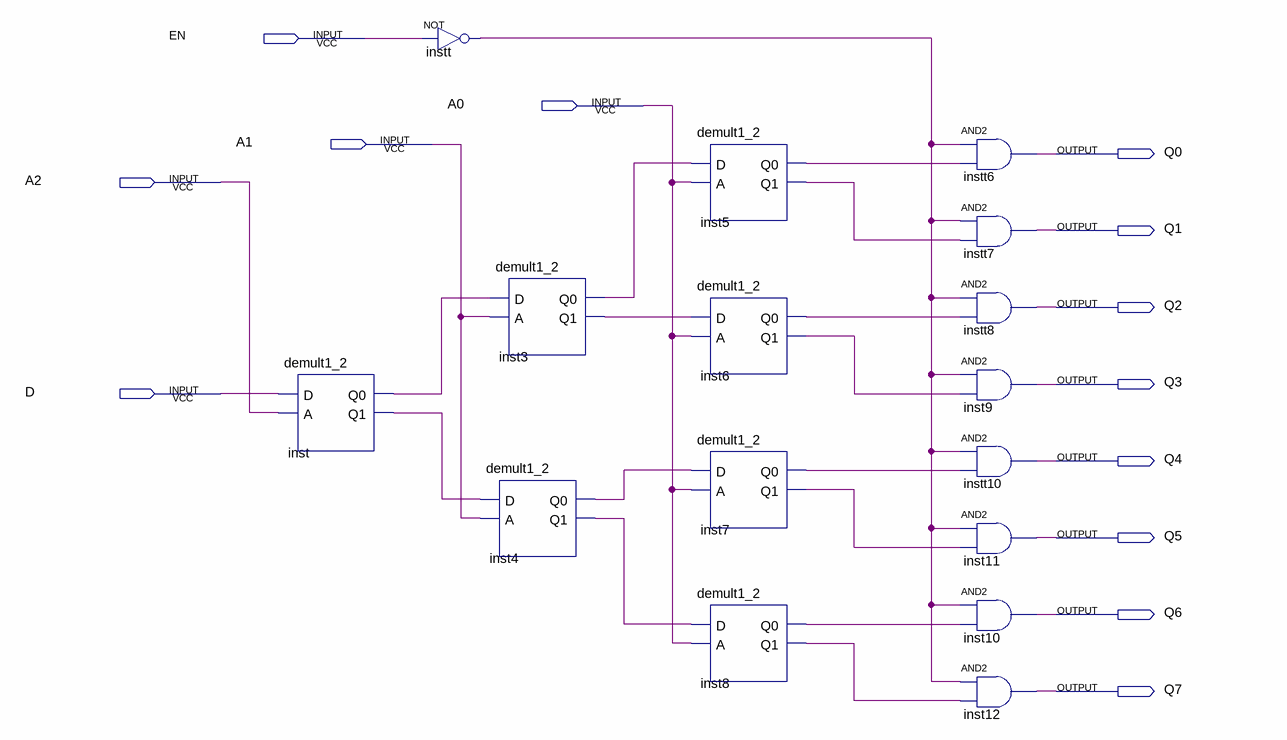
[diagram p0: schematic sheet]
// Quartus schematic Lab3_1_Quartus.bdf as structural Verilog: 16 symbols, 13 pins
module Lab3_1_Quartus (
  input  EN,
  input  A0,
  input  A1,
  input  A2,
  input  D,
  output Q0,
  output Q1,
  output Q2,
  output Q3,
  output Q4,
  output Q5,
  output Q6,
  output Q7
);

  wire inst3_q0, inst3_q1, inst4_q0, inst4_q1, inst5_q0, inst5_q1, inst6_q0, inst6_q1, inst7_q0, inst7_q1,
       inst8_q0, inst8_q1, inst_q0, inst_q1, instt_out;

  demult1_2 inst (.D(D), .A(A2), .Q0(inst_q0), .Q1(inst_q1));
  not instt (instt_out, EN);
  demult1_2 inst3 (.D(inst_q0), .A(A1), .Q0(inst3_q0), .Q1(inst3_q1));
  demult1_2 inst4 (.D(inst_q1), .A(A1), .Q0(inst4_q0), .Q1(inst4_q1));
  demult1_2 inst5 (.D(inst3_q0), .A(A0), .Q0(inst5_q0), .Q1(inst5_q1));
  demult1_2 inst6 (.D(inst3_q1), .A(A0), .Q0(inst6_q0), .Q1(inst6_q1));
  demult1_2 inst7 (.D(inst4_q0), .A(A0), .Q0(inst7_q0), .Q1(inst7_q1));
  demult1_2 inst8 (.D(inst4_q1), .A(A0), .Q0(inst8_q0), .Q1(inst8_q1));
  and instt6 (Q0, instt_out, inst5_q0);
  and instt7 (Q1, instt_out, inst5_q1);
  and instt8 (Q2, instt_out, inst6_q0);
  and inst9 (Q3, instt_out, inst6_q1);
  and instt10 (Q4, instt_out, inst7_q0);
  and inst11 (Q5, instt_out, inst7_q1);
  and inst10 (Q6, instt_out, inst8_q0);
  and inst12 (Q7, instt_out, inst8_q1);
endmodule
